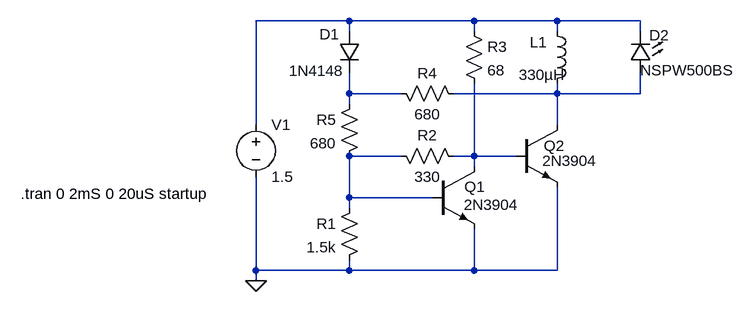
[diagram p0: schematic 2Q_1V5_Boost_Led.asc]
2Q_1V5_Boost_Led.asc, the LTspice schematic file:
Version 4
SHEET 1 880 680
WIRE -208 32 -352 32
WIRE -16 32 -208 32
WIRE 112 32 -16 32
WIRE 240 32 112 32
WIRE -208 48 -208 32
WIRE -16 48 -16 32
WIRE 112 48 112 32
WIRE 240 48 240 32
WIRE -208 144 -208 112
WIRE -128 144 -208 144
WIRE 112 144 112 128
WIRE 112 144 -48 144
WIRE 240 144 240 112
WIRE 240 144 112 144
WIRE -208 160 -208 144
WIRE -352 192 -352 32
WIRE 112 192 112 144
WIRE -128 240 -208 240
WIRE -16 240 -16 128
WIRE -16 240 -48 240
WIRE 48 240 -16 240
WIRE -16 256 -16 240
WIRE -208 304 -208 240
WIRE -80 304 -208 304
WIRE -208 320 -208 304
WIRE -352 416 -352 272
WIRE -208 416 -208 400
WIRE -208 416 -352 416
WIRE -16 416 -16 352
WIRE -16 416 -208 416
WIRE 112 416 112 288
WIRE 112 416 -16 416
WIRE -352 432 -352 416
FLAG -352 432 0
SYMBOL npn -80 256 R0
WINDOW 0 49 31 Left 0
WINDOW 3 48 59 Left 0
SYMATTR InstName Q1
SYMATTR Value 2N3904
SYMBOL npn 48 192 R0
WINDOW 0 43 32 Left 0
WINDOW 3 41 55 Left 0
SYMATTR InstName Q2
SYMATTR Value 2N3904
SYMBOL ind 96 32 R0
WINDOW 0 -26 33 Left 0
WINDOW 3 -43 83 Left 0
SYMATTR InstName L1
SYMATTR Value 330µH
SYMATTR SpiceLine Ipk=0.15 Rser=1.826 Rpar=31102 Cpar=0 mfg="Coilcraft" pn="MSS5131-334MX_"
SYMBOL res -144 224 M90
WINDOW 0 0 56 VBottom 0
WINDOW 3 32 56 VTop 0
SYMATTR InstName R2
SYMATTR Value 330
SYMBOL res -192 304 M0
SYMATTR InstName R1
SYMATTR Value 1.5k
SYMBOL res -192 144 M0
SYMATTR InstName R5
SYMATTR Value 680
SYMBOL diode -224 48 R0
WINDOW 0 -30 5 Left 0
WINDOW 3 -77 61 Left 0
SYMATTR InstName D1
SYMATTR Value 1N4148
SYMBOL res -32 32 R0
SYMATTR InstName R3
SYMATTR Value 68
SYMBOL res -144 128 M90
WINDOW 0 0 56 VBottom 0
WINDOW 3 32 56 VTop 0
SYMATTR InstName R4
SYMATTR Value 680
SYMBOL LED 256 112 R180
WINDOW 0 -28 58 Left 0
WINDOW 3 -127 4 Left 0
SYMATTR InstName D2
SYMATTR Value NSPW500BS
SYMATTR Description Diode
SYMATTR Type diode
SYMBOL voltage -352 176 R0
WINDOW 123 0 0 Left 0
WINDOW 39 0 0 Left 0
SYMATTR InstName V1
SYMATTR Value 1.5
TEXT -714 298 Left 0 !.tran 0 2mS 0 20uS startup

The netlist it stands for:
* 2Q_1V5_Boost_Led.asc
Q1 N005 N004 0 0 2N3904
Q2 N003 N005 0 0 2N3904
L1 N001 N003 330µH Ipk=0.15 Rser=1.826 Rpar=31102 Cpar=0 mfg="Coilcraft" pn="MSS5131-334MX_"
R2 N004 N005 330
R1 N004 0 1.5k
R5 N002 N004 680
D1 N001 N002 1N4148
R3 N001 N005 68
R4 N002 N003 680
D2 N003 N001 NSPW500BS
V1 N001 0 1.5
.model D D
.lib standard.dio
.model NPN NPN
.model PNP PNP
.lib standard.bjt
.tran 0 2mS 0 20uS startup
.backanno
.end